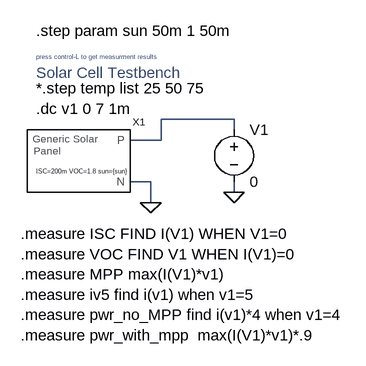
[diagram p0: schematic Generic_Solar_cell_testbench.asc]
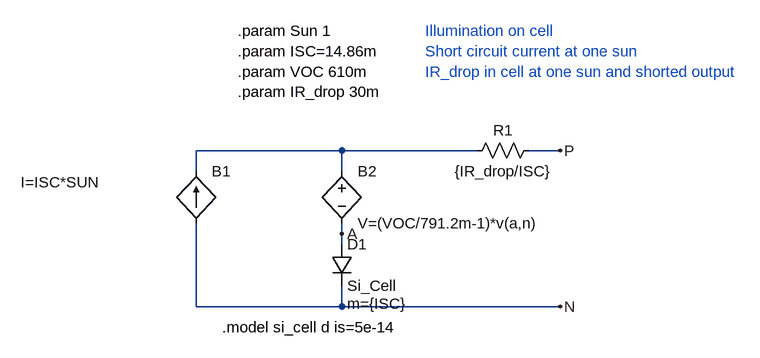
[diagram p1: sub-circuit generic_solar_panel.asc]
Generic_Solar_cell_testbench.asc, the LTspice schematic file:
Version 4
SHEET 1 880 680
WIRE 336 112 224 112
WIRE 336 128 336 112
WIRE 224 144 224 112
WIRE 224 144 176 144
WIRE 208 208 176 208
WIRE 336 224 336 208
WIRE 208 240 208 208
FLAG 208 240 0
FLAG 336 224 0
SYMBOL voltage 336 112 R0
WINDOW 123 0 0 Left 0
WINDOW 39 0 0 Left 0
SYMATTR InstName V1
SYMATTR Value 0
SYMBOL Generic_solar_panel 208 176 R0
SYMATTR Value ISC=200m VOC=1.8 sun={sun}
SYMATTR InstName X1
TEXT 32 96 Left 2 !.dc v1 0 7 1m
TEXT 8 288 Left 2 !.measure ISC FIND I(V1) WHEN V1=0\n.measure VOC FIND V1 WHEN I(V1)=0\n.measure MPP max(I(V1)*v1)\n.measure iv5 find i(v1) when v1=5\n.measure pwr_no_MPP find i(v1)*4 when v1=4\n.measure pwr_with_mpp  max(I(V1)*v1)*.9
TEXT 32 16 Left 0 ;press control-L to get measurment results
TEXT 32 40 Left 2 ;Solar Cell Testbench
TEXT 32 64 Left 2 !*.step temp list 25 50 75
TEXT 32 -24 Left 2 !.step param sun 50m 1 50m

generic_solar_panel.asc, the sub-circuit schematic file:
Version 4
SHEET 1 880 680
WIRE 176 96 -48 96
WIRE 384 96 176 96
WIRE 512 96 464 96
WIRE -48 128 -48 96
WIRE 176 128 176 96
WIRE 176 224 176 208
WIRE 176 240 176 224
WIRE -48 336 -48 208
WIRE 176 336 176 304
WIRE 176 336 -48 336
WIRE 512 336 176 336
FLAG 512 96 P
FLAG 512 336 N
FLAG 176 224 A
SYMBOL bi2 -48 128 R0
WINDOW 3 -270 17 Left 2
SYMATTR Value I=ISC*SUN
SYMATTR InstName B1
SYMBOL diode 160 240 R0
WINDOW 123 24 92 Left 2
SYMATTR Value2 m={ISC}
SYMATTR InstName D1
SYMATTR Value Si_Cell
SYMBOL res 368 112 R270
WINDOW 0 32 56 VTop 2
WINDOW 3 0 56 VBottom 2
SYMATTR InstName R1
SYMATTR Value {IR_drop/ISC}
SYMBOL bv 176 112 R0
SYMATTR InstName B2
SYMATTR Value V=(VOC/791.2m-1)*v(a,n)
TEXT -8 368 Left 2 !.model si_cell d is=5e-14
TEXT 16 -88 Left 2 !.param Sun 1\n.param ISC=14.86m\n.param VOC 610m\n.param IR_drop 30m
TEXT 304 -88 Left 2 ;Illumination on cell\nShort circuit current at one sun\nIR_drop in cell at one sun and shorted output

The netlist it stands for:
* Generic_Solar_cell_testbench.asc
V1 N001 0 0
XX1 N001 0 generic_solar_panel params: ISC=200m VOC=1.8 sun={sun}

* block symbol definitions
.subckt generic_solar_panel P N
B1 N N001 I=ISC*SUN
D1 A N Si_Cell m={ISC}
R1 N001 P {IR_drop/ISC}
B2 N001 A V=(VOC/791.2m-1)*v(a,n)
.model si_cell d is=5e-14
.param Sun 1
.param ISC=14.86m
.param VOC 610m
.param IR_drop 30m
* Illumination on cell
* Short circuit current at one sun
* IR_drop in cell at one sun and shorted output
.ends generic_solar_panel

.model D D
.lib standard.dio
.dc v1 0 7 1m
.measure ISC FIND I(V1) WHEN V1=0
.measure VOC FIND V1 WHEN I(V1)=0
.measure MPP max(I(V1)*v1)
.measure iv5 find i(v1) when v1=5
.measure pwr_no_MPP find i(v1)*4 when v1=4
.measure pwr_with_mpp  max(I(V1)*v1)*.9
* press control-L to get measurment results
* Solar Cell Testbench
*.step temp list 25 50 75
.step param sun 50m 1 50m
.backanno
.end